# Altium schematic sheet STM32F407VE.SchDoc
size A3
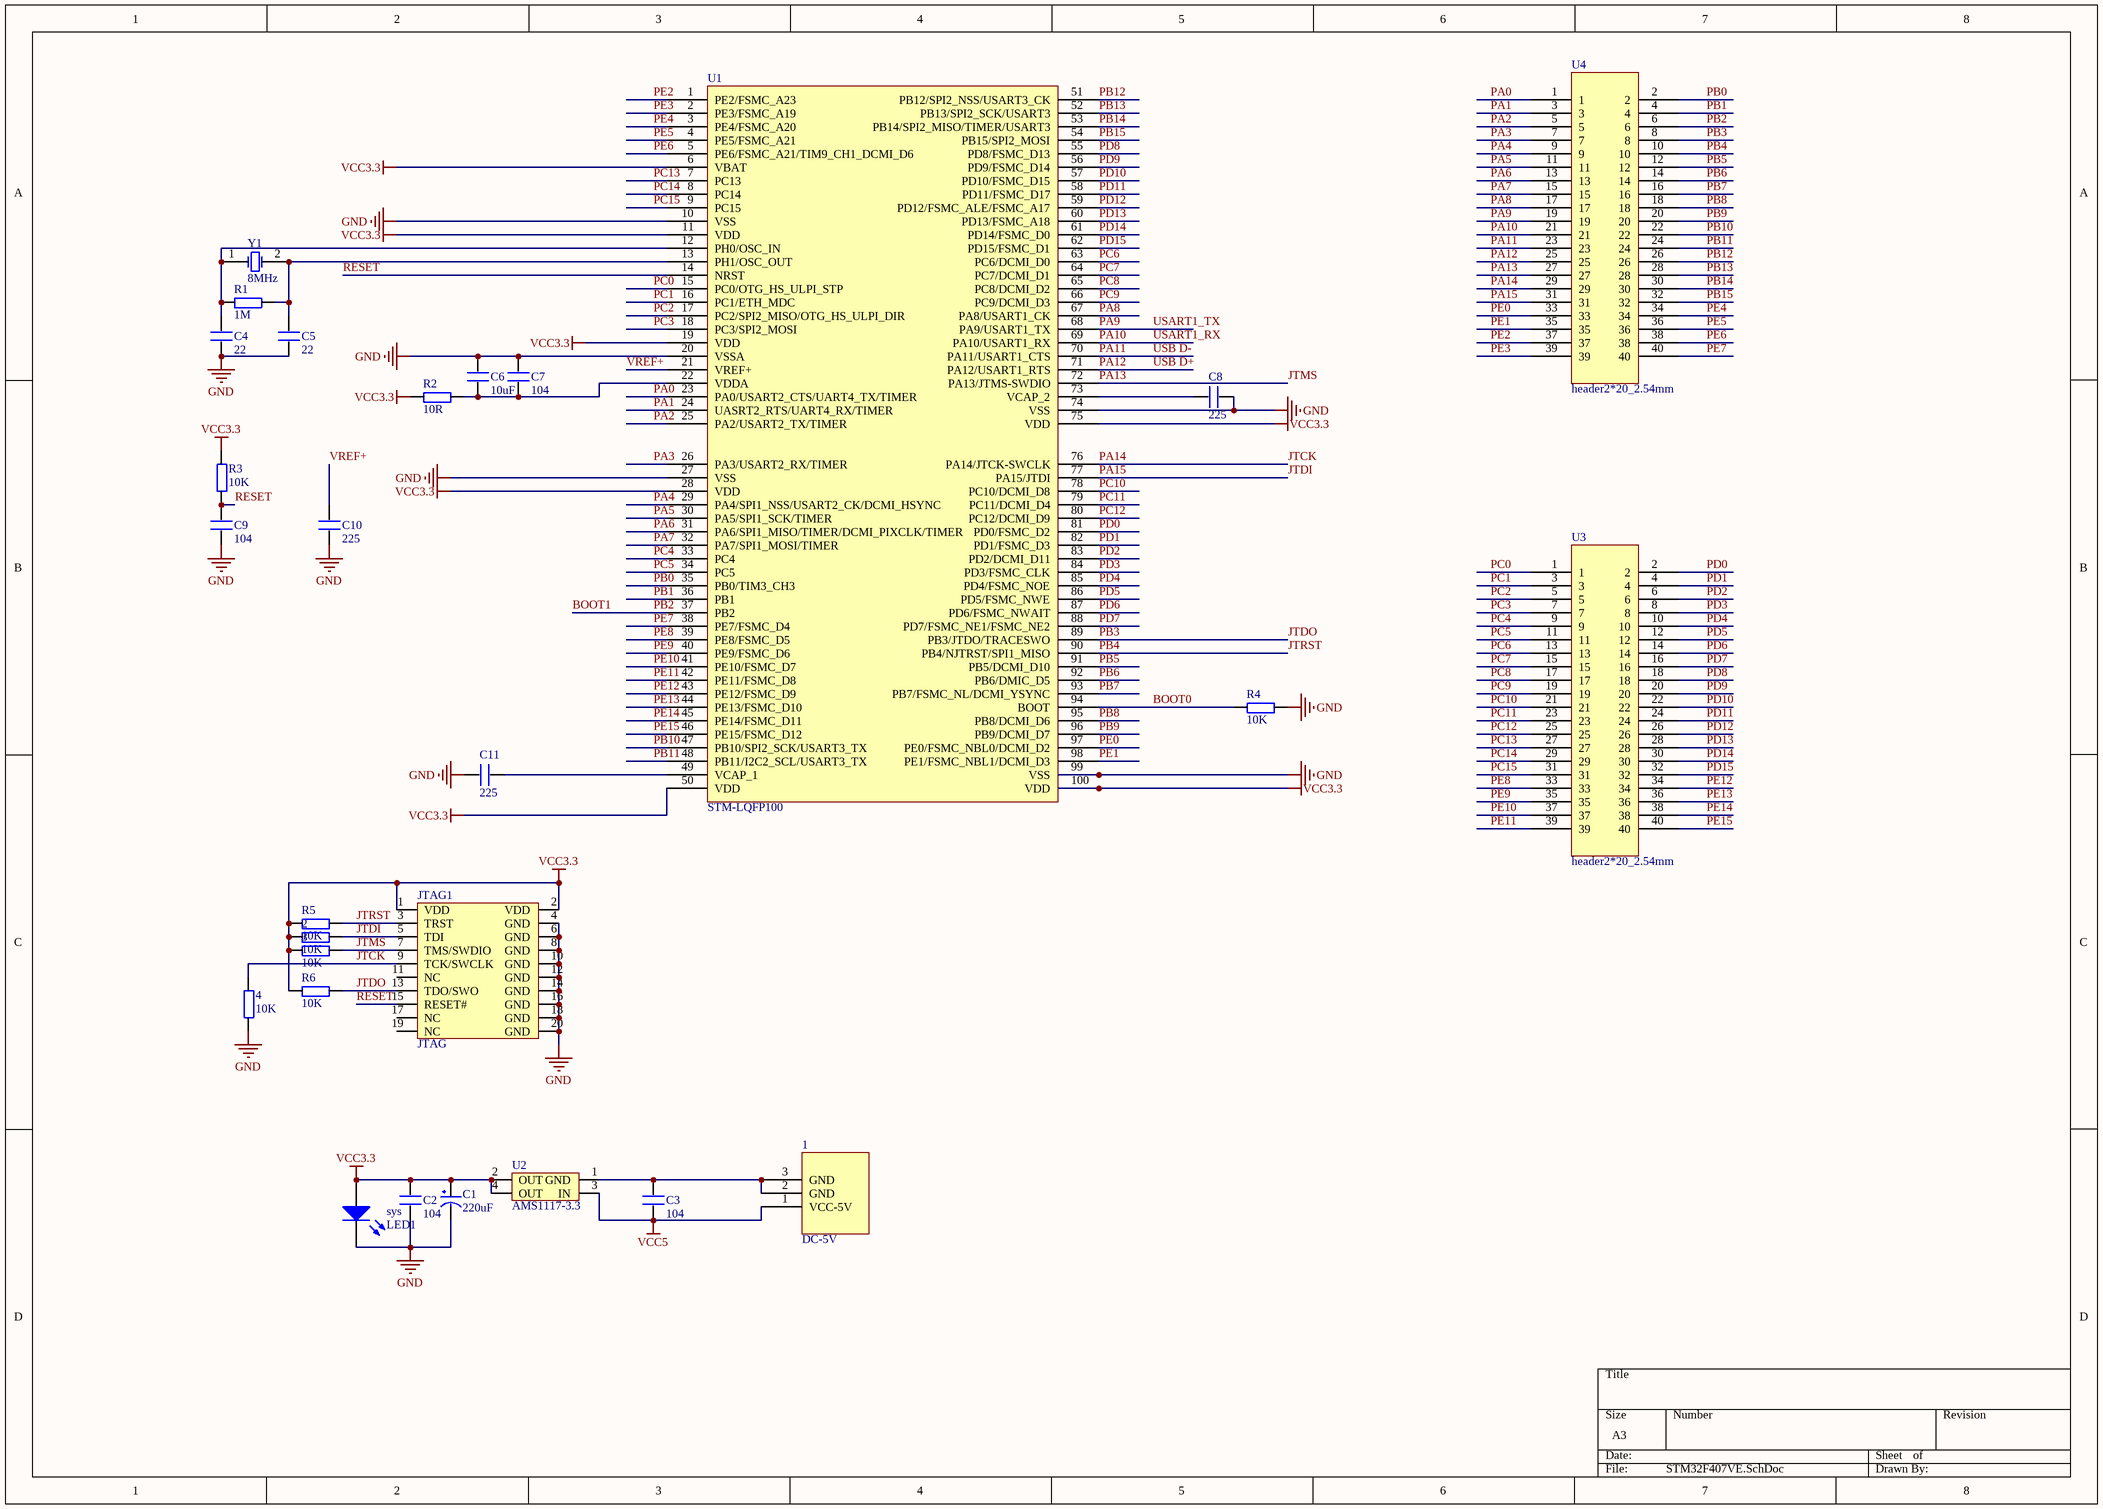
[diagram p0: STM32F407VE.SchDoc]

## Parts
1  DC-5V  [DC-5V]
2  10K  [0603P]
3  10K  [0603P]
4  10K  [0603P]
C1  220uF  [CC6.56.5]
C2  104  [0603P]
C3  104  [0603P]
C4  22  [0603P]
C5  22  [0603P]
C6  10uF  [0603P]
C7  104  [0603P]
C8  225  [0603P]
C9  104  [0603P]
C10  225  [0603P]
C11  225  [0603P]
JTAG1  JTAG  [JTAG_20]
R1  1M  [0603P]
R2  10R  [0603P]
R3  10K  [0603P]
R4  10K  [0603P]
R5  10K  [0603P]
R6  10K  [0603P]
sys  LED1  [SMDLED]
U1  STM-LQFP100  [STM-LQFP100_N]
U2  AMS1117-3.3  [AMS1117]
U3  header2*20_2.54mm  [header2*20_2.54mm]
U4  header2*20_2.54mm  [header2*20_2.54mm]
Y1  8MHz  [XTAL_US]

## Nets
GND: 4.1 C1.2(GND) C2.1 C4.1 C5.1 C6.2 C7.2 C8.2 C9.1 C10.1 C11.1 JTAG1.4(GND) JTAG1.6(GND) JTAG1.8(GND) JTAG1.10(GND) JTAG1.12(GND) JTAG1.14(GND) JTAG1.16(GND) JTAG1.18(GND) JTAG1.20(GND) R4.2 sys.2(K) U1.10(VSS) U1.20(VSSA) U1.27(VSS) U1.74(VSS) U1.99(VSS)
VCC3.3: 2.1 3.1 C1.1(VCC) C2.2 JTAG1.1(VDD) JTAG1.2(VDD) R2.1 R3.2 R5.1 R6.1 sys.1(A) U1.6(VBAT) U1.11(VDD) U1.19(VDD) U1.28(VDD) U1.50(VDD) U1.75(VDD) U1.100(VDD) U2.2(OUT) U2.4(OUT)
VCC5: 1.1(VCC-5V) C3.1 U2.3(IN)
BOOT0: R4.1 U1.94(BOOT)
BOOT1: U1.37(PB2) U4.6  [also labelled PB2]
JTCK: 4.2 JTAG1.9(TCK/SWCLK) U1.76(PA14/JTCK-SWCLK) U4.29  [also labelled PA14]
JTDI: 2.2 JTAG1.5(TDI) U1.77(PA15/JTDI) U4.31  [also labelled PA15]
JTDO: JTAG1.13(TDO/SWO) R6.2 U1.89(PB3/JTDO/TRACESWO) U4.8  [also labelled PB3]
JTMS: 3.2 JTAG1.7(TMS/SWDIO) U1.72(PA13/JTMS-SWDIO) U4.27  [also labelled PA13]
JTRST: JTAG1.3(TRST) R5.2 U1.90(PB4/NJTRST/SPI1_MISO) U4.10  [also labelled PB4]
PA0: U1.23(PA0/USART2_CTS/UART4_TX/TIMER) U4.1
PA1: U1.24(UASRT2_RTS/UART4_RX/TIMER) U4.3
PA2: U1.25(PA2/USART2_TX/TIMER) U4.5
PA3: U1.26(PA3/USART2_RX/TIMER) U4.7
PA4: U1.29(PA4/SPI1_NSS/USART2_CK/DCMI_HSYNC) U4.9
PA5: U1.30(PA5/SPI1_SCK/TIMER) U4.11
PA6: U1.31(PA6/SPI1_MISO/TIMER/DCMI_PIXCLK/TIMER) U4.13
PA7: U1.32(PA7/SPI1_MOSI/TIMER) U4.15
PA8: U1.67(PA8/USART1_CK) U4.17
PA9: U1.68(PA9/USART1_TX) U4.19  [also labelled USART1_TX]
PA10: U1.69(PA10/USART1_RX) U4.21  [also labelled USART1_RX]
PA11: U1.70(PA11/USART1_CTS) U4.23  [also labelled USB D-]
PA12: U1.71(PA12/USART1_RTS) U4.25  [also labelled USB D+]
PB0: U1.35(PB0/TIM3_CH3) U4.2
PB1: U1.36(PB1) U4.4
PB5: U1.91(PB5/DCMI_D10) U4.12
PB6: U1.92(PB6/DMIC_D5) U4.14
PB7: U1.93(PB7/FSMC_NL/DCMI_YSYNC) U4.16
PB8: U1.95(PB8/DCMI_D6) U4.18
PB9: U1.96(PB9/DCMI_D7) U4.20
PB10: U1.47(PB10/SPI2_SCK/USART3_TX) U4.22
PB11: U1.48(PB11/I2C2_SCL/USART3_TX) U4.24
PB12: U1.51(PB12/SPI2_NSS/USART3_CK) U4.26
PB13: U1.52(PB13/SPI2_SCK/USART3) U4.28
PB14: U1.53(PB14/SPI2_MISO/TIMER/USART3) U4.30
PB15: U1.54(PB15/SPI2_MOSI) U4.32
PC0: U1.15(PC0/OTG_HS_ULPI_STP) U3.1
PC1: U1.16(PC1/ETH_MDC) U3.3
PC2: U1.17(PC2/SPI2_MISO/OTG_HS_ULPI_DIR) U3.5
PC3: U1.18(PC3/SPI2_MOSI) U3.7
PC4: U1.33(PC4) U3.9
PC5: U1.34(PC5) U3.11
PC6: U1.63(PC6/DCMI_D0) U3.13
PC7: U1.64(PC7/DCMI_D1) U3.15
PC8: U1.65(PC8/DCMI_D2) U3.17
PC9: U1.66(PC9/DCMI_D3) U3.19
PC10: U1.78(PC10/DCMI_D8) U3.21
PC11: U1.79(PC11/DCMI_D4) U3.23
PC12: U1.80(PC12/DCMI_D9) U3.25
PC13: U1.7(PC13) U3.27
PC14: U1.8(PC14) U3.29
PC15: U1.9(PC15) U3.31
PD0: U1.81(PD0/FSMC_D2) U3.2
PD1: U1.82(PD1/FSMC_D3) U3.4
PD2: U1.83(PD2/DCMI_D11) U3.6
PD3: U1.84(PD3/FSMC_CLK) U3.8
PD4: U1.85(PD4/FSMC_NOE) U3.10
PD5: U1.86(PD5/FSMC_NWE) U3.12
PD6: U1.87(PD6/FSMC_NWAIT) U3.14
PD7: U1.88(PD7/FSMC_NE1/FSMC_NE2) U3.16
PD8: U1.55(PD8/FSMC_D13) U3.18
PD9: U1.56(PD9/FSMC_D14) U3.20
PD10: U1.57(PD10/FSMC_D15) U3.22
PD11: U1.58(PD11/FSMC_D17) U3.24
PD12: U1.59(PD12/FSMC_ALE/FSMC_A17) U3.26
PD13: U1.60(PD13/FSMC_A18) U3.28
PD14: U1.61(PD14/FSMC_D0) U3.30
PD15: U1.62(PD15/FSMC_D1) U3.32
PE0: U1.97(PE0/FSMC_NBL0/DCMI_D2) U4.33
PE1: U1.98(PE1/FSMC_NBL1/DCMI_D3) U4.35
PE2: U1.1(PE2/FSMC_A23) U4.37
PE3: U1.2(PE3/FSMC_A19) U4.39
PE4: U1.3(PE4/FSMC_A20) U4.34
PE5: U1.4(PE5/FSMC_A21) U4.36
PE6: U1.5(PE6/FSMC_A21/TIM9_CH1_DCMI_D6) U4.38
PE7: U1.38(PE7/FSMC_D4) U4.40
PE8: U1.39(PE8/FSMC_D5) U3.33
PE9: U1.40(PE9/FSMC_D6) U3.35
PE10: U1.41(PE10/FSMC_D7) U3.37
PE11: U1.42(PE11/FSMC_D8) U3.39
PE12: U1.43(PE12/FSMC_D9) U3.34
PE13: U1.44(PE13/FSMC_D10) U3.36
PE14: U1.45(PE14/FSMC_D11) U3.38
PE15: U1.46(PE15/FSMC_D12) U3.40
RESET: C9.2 JTAG1.15(RESET#) R3.1 U1.14(NRST)
VREF+: C10.2 U1.21(VREF+)
Net1_2: 1.2(GND) 1.3(GND) C3.2 U2.1(GND)
NetC4_2: C4.2 R1.1 U1.12(PH0/OSC_IN) Y1.1(OSC1)
NetC5_2: C5.2 R1.2 U1.13(PH1/OSC_OUT) Y1.2(OSC2)
NetC6_1: C6.1 C7.1 R2.2 U1.22(VDDA)
NetC8_1: C8.1 U1.73(VCAP_2)
NetC11_2: C11.2 U1.49(VCAP_1)

Not connected (* = marked no-connect by the designer): JTAG1 11(NC) 17(NC) 19(NC)

## Library data of the parts
2-4 R1-R6 = R
C1 = CAP
C2-C11 = C
sys = LED2: Typical RED, GREEN, YELLOW, AMBER GaAs LED; Published: 8-Jun-2000; LatestRevisionDate: 17-Jul-2002; LatestRevisionNote: Re-released for DXP Platform.; PackageDocument: Feb-2002; PackageReference: 3.2X1.6X1.1; Publisher: Altium Limited
U2 = AMS1117
Y1 = XTAL: Crystal Oscillator; Published: 8-Jun-2000; LatestRevisionDate: 17-Jul-2002; LatestRevisionNote: Re-released for DXP Platform.; Publisher: Altium Limited